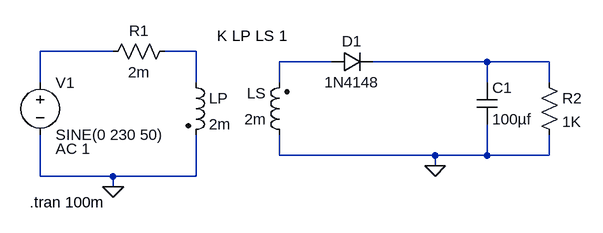
[diagram p0: schematic Half Wave Rectifier.asc]
Half Wave Rectifier.asc, the LTspice schematic file:
Version 4
SHEET 1 1024 680
WIRE 256 240 144 240
WIRE 384 240 336 240
WIRE 592 256 512 256
WIRE 832 256 656 256
WIRE 928 256 832 256
WIRE 144 288 144 240
WIRE 384 288 384 240
WIRE 512 288 512 256
WIRE 832 288 832 256
WIRE 928 288 928 256
WIRE 512 400 512 368
WIRE 752 400 512 400
WIRE 832 400 832 352
WIRE 832 400 752 400
WIRE 928 400 928 368
WIRE 928 400 832 400
WIRE 752 416 752 400
WIRE 144 432 144 368
WIRE 256 432 144 432
WIRE 384 432 384 368
WIRE 384 432 256 432
WIRE 256 448 256 432
FLAG 752 416 0
FLAG 256 448 0
SYMBOL voltage 144 272 R0
WINDOW 123 24 118 Left 2
SYMATTR Value2 AC 1
SYMATTR InstName V1
SYMATTR Value SINE(0 230 50)
SYMBOL res 352 224 R90
WINDOW 0 0 56 VBottom 2
WINDOW 3 32 56 VTop 2
SYMATTR InstName R1
SYMATTR Value 2m
SYMBOL ind2 368 272 R0
SYMATTR InstName LP
SYMATTR Value 2m
SYMATTR Type ind
SYMBOL diode 592 272 R270
WINDOW 0 32 32 VTop 2
WINDOW 3 0 32 VBottom 2
SYMATTR InstName D1
SYMATTR Value 1N4148
SYMBOL res 912 272 R0
SYMATTR InstName R2
SYMATTR Value 1K
SYMBOL ind2 528 384 R180
WINDOW 0 36 80 Left 2
WINDOW 3 36 40 Left 2
SYMATTR InstName LS
SYMATTR Value 2m
SYMATTR Type ind
SYMBOL cap 816 288 R0
SYMATTR InstName C1
SYMATTR Value 100µf
TEXT 416 216 Left 2 !K LP LS 1
TEXT 128 472 Left 2 !.tran 100m

The netlist it stands for:
* Half Wave Rectifier.asc
V1 N001 0 SINE(0 230 50) AC 1
R1 N002 N001 2m
LP N002 0 2m
D1 N003 N004 1N4148
R2 N004 0 1K
LS 0 N003 2m
C1 N004 0 100µf
.model D D
.lib standard.dio
K LP LS 1
.tran 100m
.backanno
.end